# Altium schematic sheet CRUVI.SchDoc: CRUVI
size A4; Organization: Trenz Electronic GmbH; DocumentNumber: CR00041; Revision: 01; SheetNumber: 1; SheetTotal: 2; Date: 2019-11-14; CompanyName: Trenz Electronic GmbH
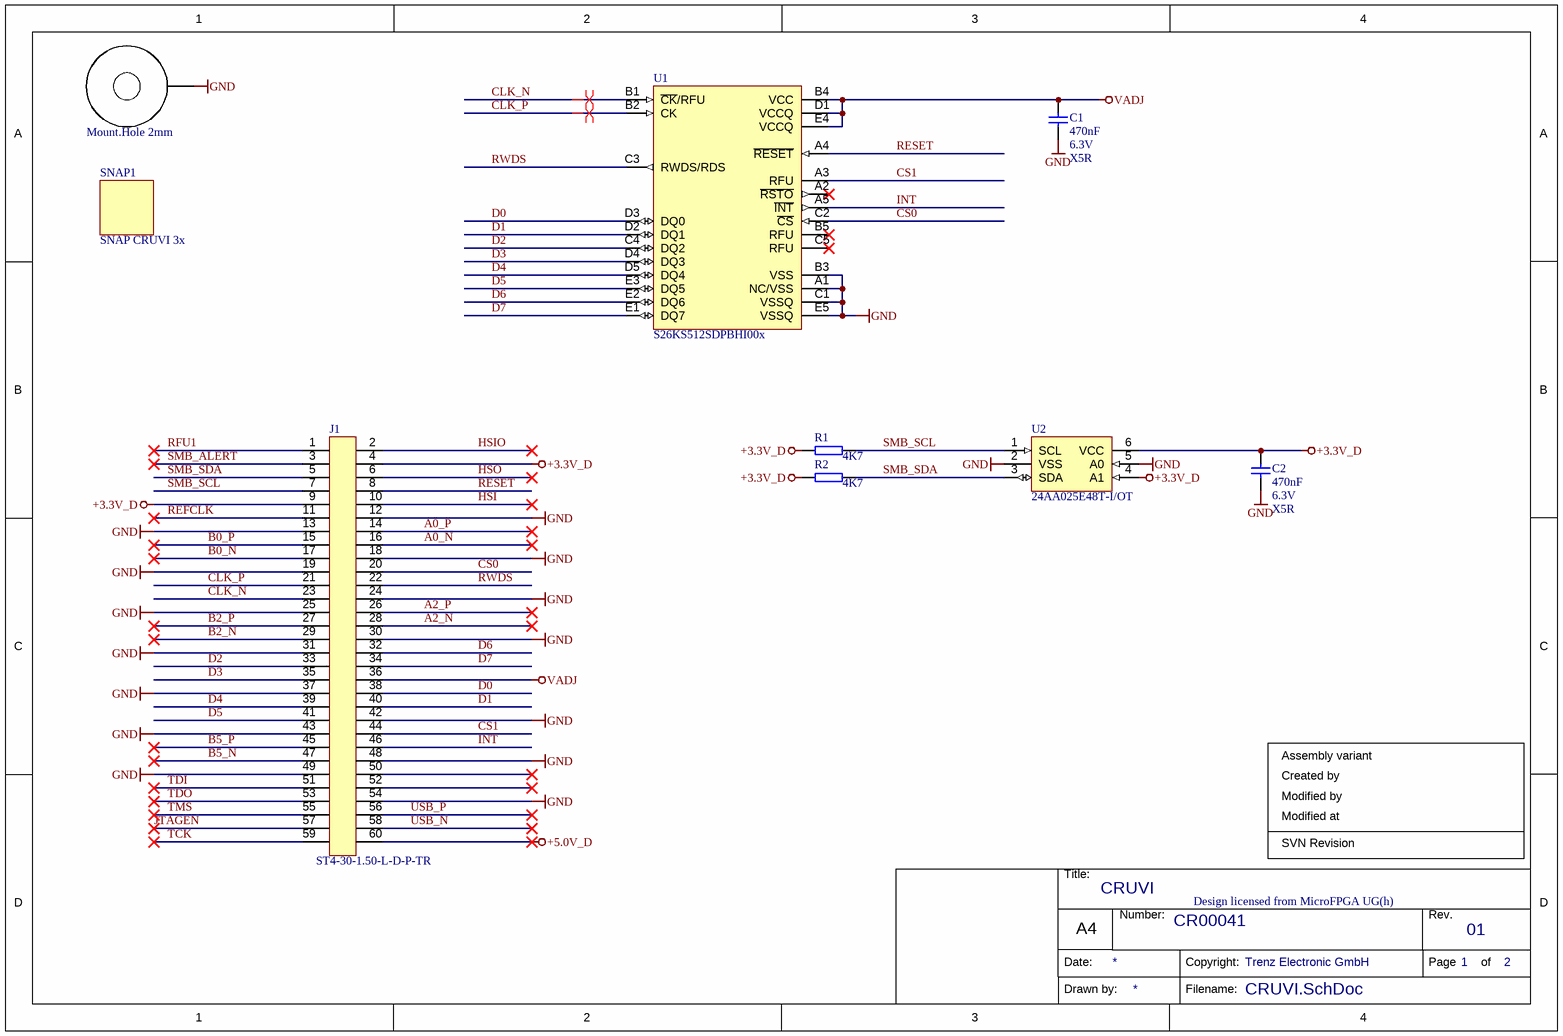
[diagram p0: CRUVI.SchDoc]

## Parts
C1  470nF  Voltage: 6.3V  Technology: X5R  [CAPC1005X55N]
C2  470nF  Voltage: 6.3V  Technology: X5R  [CAPC1005X55N]
H3  Mount.Hole 2mm  [MHole2_2mm]  (no BOM)
J1  ST4-30-1.50-L-D-P-TR  [ST4-30-1_50-L-D]
R1  4K7  [RESC1005X40N]
R2  4K7  [RESC1005X40N]
SNAP1  SNAP CRUVI 3x  [CRUVI_3x_Snap]  (no BOM)
U1  S26KS512SDPBHI00x  [BGA25C100P5X5_800X600X120N]
U2  24AA025E48T-I/OT  [SOT95P280X145-6N]

## Nets
+3.3V_D: C2.1 J1.4 J1.9 R1.1 R2.1 U2.4(A1) U2.6(VCC)
+5.0V_D: J1.60
GND: C1.2 C2.2 H3.1 J1.12 J1.13 J1.18 J1.19 J1.24 J1.25 J1.30 J1.31 J1.37 J1.42 J1.43 J1.48 J1.49 J1.54 U1.A1(NC/VSS) U1.B3(VSS) U1.C1(VSSQ) U1.E5(VSSQ) U2.2(VSS) U2.5(A0)
VADJ: C1.1 J1.36 U1.B4(VCC) U1.D1(VCCQ) U1.E4(VCCQ)
A0_N: J1.16
A0_P: J1.14
A2_N: J1.28
A2_P: J1.26
B0_N: J1.17
B0_P: J1.15
B2_N: J1.29
B2_P: J1.27
B5_N: J1.47
B5_P: J1.45
CLK_N: J1.23 U1.B1(~{CK}/RFU)
CLK_P: J1.21 U1.B2(CK)
CS0: J1.20 U1.C2(~{CS})
CS1: J1.44 U1.A3(RFU)
D0: J1.38 U1.D3(DQ0)
D1: J1.40 U1.D2(DQ1)
D2: J1.33 U1.C4(DQ2)
D3: J1.35 U1.D4(DQ3)
D4: J1.39 U1.D5(DQ4)
D5: J1.41 U1.E3(DQ5)
D6: J1.32 U1.E2(DQ6)
D7: J1.34 U1.E1(DQ7)
HSI: J1.10
HSIO: J1.2
HSO: J1.6
INT: J1.46 U1.A5(~{INT})
JTAGEN: J1.57
REFCLK: J1.11
RESET: J1.8 U1.A4(~{RESET})
RFU1: J1.1
RWDS: J1.22 U1.C3(RWDS/RDS)
SMB_ALERT: J1.3
SMB_SCL: J1.7 R1.2 U2.1(SCL)
SMB_SDA: J1.5 R2.2 U2.3(SDA)
TCK: J1.59
TDI: J1.51
TDO: J1.53
TMS: J1.55
USB_N: J1.58
USB_P: J1.56

Not connected (* = marked no-connect by the designer): J1 50* 52*; U1 A2(~{RSTO})* B5(RFU)* C5(RFU)*

## Layout directives
differential pair: CLK_N, CLK_P

## Notes on the sheet
- Assembly variant
- Created by
- Modified at
- Modified by
- SVN Revision
- Design licensed from MicroFPGA UG(h)
- Title:
- Number:
- Rev.
- Date:
- A4
- Copyright:
- Page
- of
- Drawn by:
- Filename:

## Library data of the parts
C1 C2 = 23659: KON 470nF 6,3V X5R SMD BF 1005 (0402); AN: 23659; Mixed: SMT; Value: 470n; Preferred: Yes; Temperature-Range: -55/+85; Case: 1005 (0402)
H3 = 27273: AN: 27273; Mixed: THT
J1 = 29686: AN: 29686; Mixed: SMT; Temperature-Range: -55/+125; Case: ST4; HelpURL: b:\AD\adlib\datasheet\Samtec_ST4\; H-ART: ST4-30-1.50-L-D-P-TR
R1 R2 = 22585: WID SMD 4K7 1% 0,063W BF 1005 (0402); AN: 22585; Mixed: SMT; Value: 4.7K; Preferred: Yes; H-ART: RC0402FR-134K7L; Tolerance: 1%; Case: 1005 (0402); Technology: TK100
SNAP1 = 29977: SNAP for CRUVI 3x; AN: 29977
U1 = 26436: S26KS512SDPBHI00x 1.8V; AN: 26436; Mixed: SMT; Trenz-Stock: Yes; Case: TFBGA25; HelpURL: B:\ad\adlib\datasheet\S26KS_KL-S; Preferred: Yes; H-ART: S26KS512SDPBHI00x
U2 = 26249: AN: 26249; Mixed: SMT; Temperature-Range: -40/+85; Case: SOT23-6; HelpURL: B:\AD\adlib\datasheet\24AA02xExx; H-ART: 24AA025E48T-I/OT